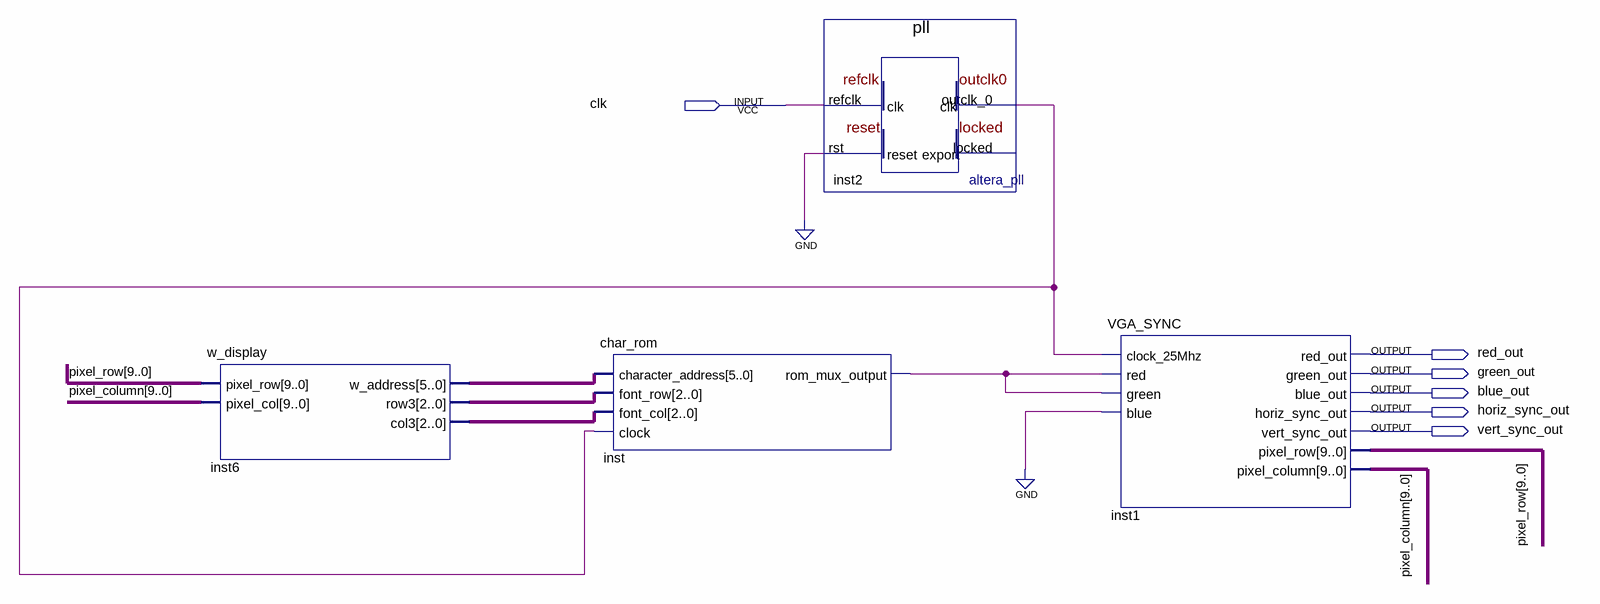
[diagram p0: schematic sheet]
// Quartus schematic text_display.bdf as structural Verilog: 4 symbols, 6 pins
module text_display (
  input  clk,
  output red_out,
  output green_out,
  output blue_out,
  output horiz_sync_out,
  output vert_sync_out
);

  wire inst2_outclk_0, inst_rom_mux_output;
  wire [2:0] inst6_col3, inst6_row3;
  wire [5:0] inst6_w_address;
  wire [9:0] pixel_column, pixel_row;

  w_display inst6 (
    .pixel_row(pixel_row), .pixel_col(pixel_column), .w_address(inst6_w_address), .row3(inst6_row3),
    .col3(inst6_col3));
  char_rom inst (
    .character_address(inst6_w_address), .font_row(inst6_row3), .font_col(inst6_col3),
    .clock(inst2_outclk_0), .rom_mux_output(inst_rom_mux_output));
  pll inst2 (.refclk(clk), .rst(1'b0), .outclk_0(inst2_outclk_0));  // open: locked
  VGA_SYNC inst1 (
    .clock_25Mhz(inst2_outclk_0), .red(inst_rom_mux_output), .green(inst_rom_mux_output), .blue(1'b0),
    .red_out(red_out), .green_out(green_out), .blue_out(blue_out), .horiz_sync_out(horiz_sync_out),
    .vert_sync_out(vert_sync_out), .pixel_row(pixel_row), .pixel_column(pixel_column));
endmodule
